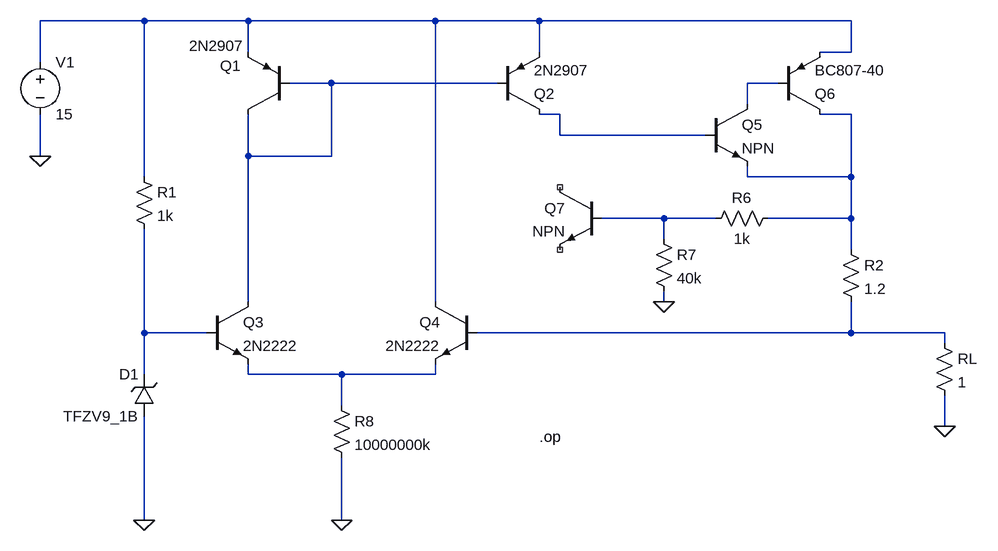
[diagram p0: schematic Ej2.asc]
Ej2.asc, the LTspice schematic file:
Version 4
SHEET 1 1256 880
WIRE -64 16 -224 16
WIRE 96 16 -64 16
WIRE 384 16 96 16
WIRE 544 16 384 16
WIRE 1024 16 544 16
WIRE 96 64 96 16
WIRE 544 64 544 16
WIRE 1024 64 1024 16
WIRE 1024 64 976 64
WIRE -224 80 -224 16
WIRE 224 112 160 112
WIRE 480 112 224 112
WIRE 912 112 864 112
WIRE 864 144 864 112
WIRE 576 160 544 160
WIRE 1024 160 976 160
WIRE 576 192 576 160
WIRE 800 192 576 192
WIRE -224 224 -224 160
WIRE 96 224 96 160
WIRE 224 224 224 112
WIRE 224 224 96 224
WIRE -64 256 -64 16
WIRE 864 256 864 240
WIRE 1024 256 1024 160
WIRE 1024 256 864 256
WIRE 736 320 640 320
WIRE 816 320 736 320
WIRE 1024 320 1024 256
WIRE 1024 320 896 320
WIRE 736 352 736 320
WIRE 1024 368 1024 320
WIRE 96 448 96 224
WIRE 384 448 384 16
WIRE 736 448 736 432
WIRE -64 496 -64 336
WIRE 32 496 -64 496
WIRE 1024 496 1024 448
WIRE 1024 496 448 496
WIRE 1168 496 1024 496
WIRE 1168 512 1168 496
WIRE -64 560 -64 496
WIRE 96 560 96 544
WIRE 240 560 96 560
WIRE 384 560 384 544
WIRE 384 560 240 560
WIRE 240 608 240 560
WIRE 1168 640 1168 592
WIRE -64 784 -64 624
WIRE 240 784 240 688
FLAG 240 784 0
FLAG -64 784 0
FLAG 736 448 0
FLAG 1168 640 0
FLAG -224 224 0
DATAFLAG 240 560 ""
DATAFLAG -64 496 ""
DATAFLAG 1168 496 ""
DATAFLAG 1088 176 "Ic(Q6)"
DATAFLAG 960 256 "Ie(Q5)"
DATAFLAG 672 192 "Ib(Q5)"
DATAFLAG 96 192 "Ie(Q1)"
DATAFLAG 240 752 "I(R8)"
DATAFLAG 96 400 "Ic(Q3)"
DATAFLAG 224 112 ""
DATAFLAG 384 336 "Ic(Q4)"
SYMBOL pnp 160 160 R180
WINDOW 0 75 75 Left 2
WINDOW 3 70 106 Left 2
SYMATTR InstName Q1
SYMATTR Value 2N2907
SYMBOL pnp 480 160 M180
SYMATTR InstName Q2
SYMATTR Value 2N2907
SYMBOL npn 32 448 R0
SYMATTR InstName Q3
SYMATTR Value 2N2222
SYMBOL npn 448 448 M0
SYMATTR InstName Q4
SYMATTR Value 2N2222
SYMBOL res 224 592 R0
SYMATTR InstName R8
SYMATTR Value 10000000k
SYMBOL zener -48 624 R180
WINDOW 0 24 64 Left 2
WINDOW 3 24 0 Left 2
SYMATTR InstName D1
SYMATTR Value TFZV9_1B
SYMBOL res -80 240 R0
SYMATTR InstName R1
SYMATTR Value 1k
SYMBOL npn 640 272 M0
SYMATTR InstName Q7
SYMBOL res 800 336 R270
WINDOW 0 32 56 VTop 2
WINDOW 3 0 56 VBottom 2
SYMATTR InstName R6
SYMATTR Value 1k
SYMBOL res 720 336 R0
SYMATTR InstName R7
SYMATTR Value 40k
SYMBOL npn 800 144 R0
SYMATTR InstName Q5
SYMBOL pnp 912 160 M180
SYMATTR InstName Q6
SYMATTR Value BC807-40
SYMBOL res 1008 352 R0
SYMATTR InstName R2
SYMATTR Value 1.2
SYMBOL res 1152 496 R0
SYMATTR InstName RL
SYMATTR Value 1
SYMBOL voltage -224 64 R0
SYMATTR InstName V1
SYMATTR Value 15
TEXT 544 656 Left 2 !.op

The netlist it stands for:
* Ej2.asc
Q1 N002 N002 N001 0 2N2907
Q2 N004 N002 N001 0 2N2907
Q3 N002 N007 N009 0 2N2222
Q4 N001 N008 N009 0 2N2222
R8 N009 0 10000000k
D1 0 N007 TFZV9_1B
R1 N001 N007 1k
Q7 NC_01 N006 NC_02 0 NPN
R6 N006 N005 1k
R7 N006 0 40k
Q5 N003 N004 N005 0 NPN
Q6 N005 N003 N001 0 BC807-40
R2 N005 N008 1.2
RL N008 0 1
V1 N001 0 15
.model D D
.lib standard.dio
.model NPN NPN
.model PNP PNP
.lib standard.bjt
.op
.backanno
.end